# EAGLE schematic board (EAGLE 6.5.0)
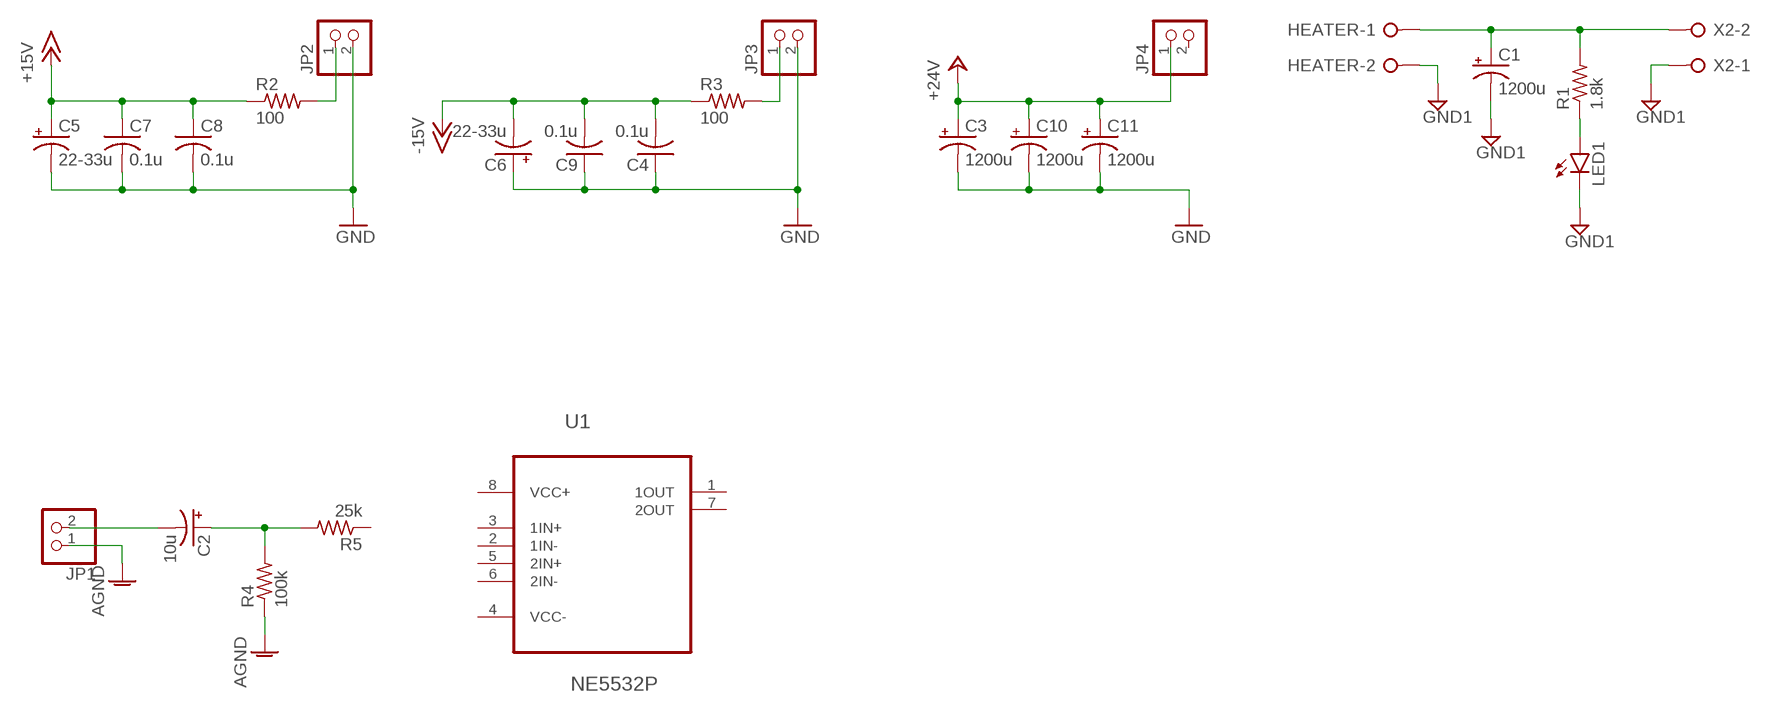
[diagram p0: schematic, sheet 1]

## Parts
C1  1200u  CPOL-USE7.5-18  [E7,5-18]
C2  10u  CPOL-USE2.5-7  [E2,5-7]
C3  1200u  CPOL-USE7.5-18  [E7,5-18]
C4  0.1u  C-USC1206  [C1206]
C5  22-33u  CPOL-USE2-5  [E2-5]
C6  22-33u  CPOL-USE2-5  [E2-5]
C7  0.1u  C-USC1206  [C1206]
C8  0.1u  C-USC1206  [C1206]
C9  0.1u  C-USC1206  [C1206]
C10  1200u  CPOL-USE7.5-18  [E7,5-18]
C11  1200u  CPOL-USE7.5-18  [E7,5-18]
HEATER  W237-02P  [W237-132]
JP1  PINHD-1X2  [1X02]
JP2  PINHD-1X2  [1X02]
JP3  PINHD-1X2  [1X02]
JP4  PINHD-1X2  [1X02]
LED1  LED1206  [LED-1206]
R1  1.8k  R-US_R1206  [R1206]
R2  100  R-US_0207/7  [0207/7]
R3  100  R-US_0207/7  [0207/7]
R4  100k  R-US_0207/7  [0207/7]
R5  25k  R-US_0207/7  [0207/7]
U1  NE5532P  [DIP254P762X508-8]
X2  W237-02P  [W237-132]

## Nets
+15V: C5.+ C7.1 C8.1 R2.1
+24V: C3.+ C10.+ C11.+ JP4.1
-15V: C4.2 C6.- C9.2 R3.1
AGND: JP1.1 R4.1
GND: C3.- C4.1 C5.- C6.+ C7.2 C8.2 C9.1 C10.- C11.- JP2.2 JP3.2
GND1: C1.- HEATER.2 LED1.C X2.1
N$1: C2.- JP1.2
N$2: C1.+ HEATER.1 R1.2 X2.2
N$3: LED1.A R1.1
N$4: JP2.1 R2.2
N$5: C2.+ R4.2 R5.2
N$6: JP3.1 R3.2
Unconnected: JP4.2 R5.1 U1.1(1OUT) U1.2(1IN-) U1.3(1IN+) U1.5(2IN+) U1.6(2IN-) U1.7(2OUT)

## Power pins joined to a net without a drawn wire
VCC+: U1.8(VCC+)
VCC-: U1.4(VCC-)

## Library data of the parts
C1-C3 C5 C6 C10 C11 = rcl:CPOL-US: POLARIZED CAPACITOR, American symbol
C4 C7-C9 = rcl:C-US: CAPACITOR, American symbol
HEATER X2 = con-wago-508:W237-02P: WAGO SREW CLAMP; OC_FARNELL: unknown; OC_NEWARK: unknown
JP1-JP4 = pinhead:PINHD-1X2: PIN HEADER
LED1 = SparkFun-LED:LED: LEDs Standard schematic elements and footprints for 5mm, 3mm, 1206, and 0603 sized LEDs. 5mm - Spark Fun Electronics SKU : COM-00529 (and others)
R1-R5 = rcl:R-US_: RESISTOR, American symbol
U1 = ne5532:NE5532P: OPERATIONAL AMPLIFIERS; MPN: NE5532P; OC_FARNELL: 1106092; OC_NEWARK: 59K8751; PACKAGE: PDIP; SUPPLIER: Texas Instruments